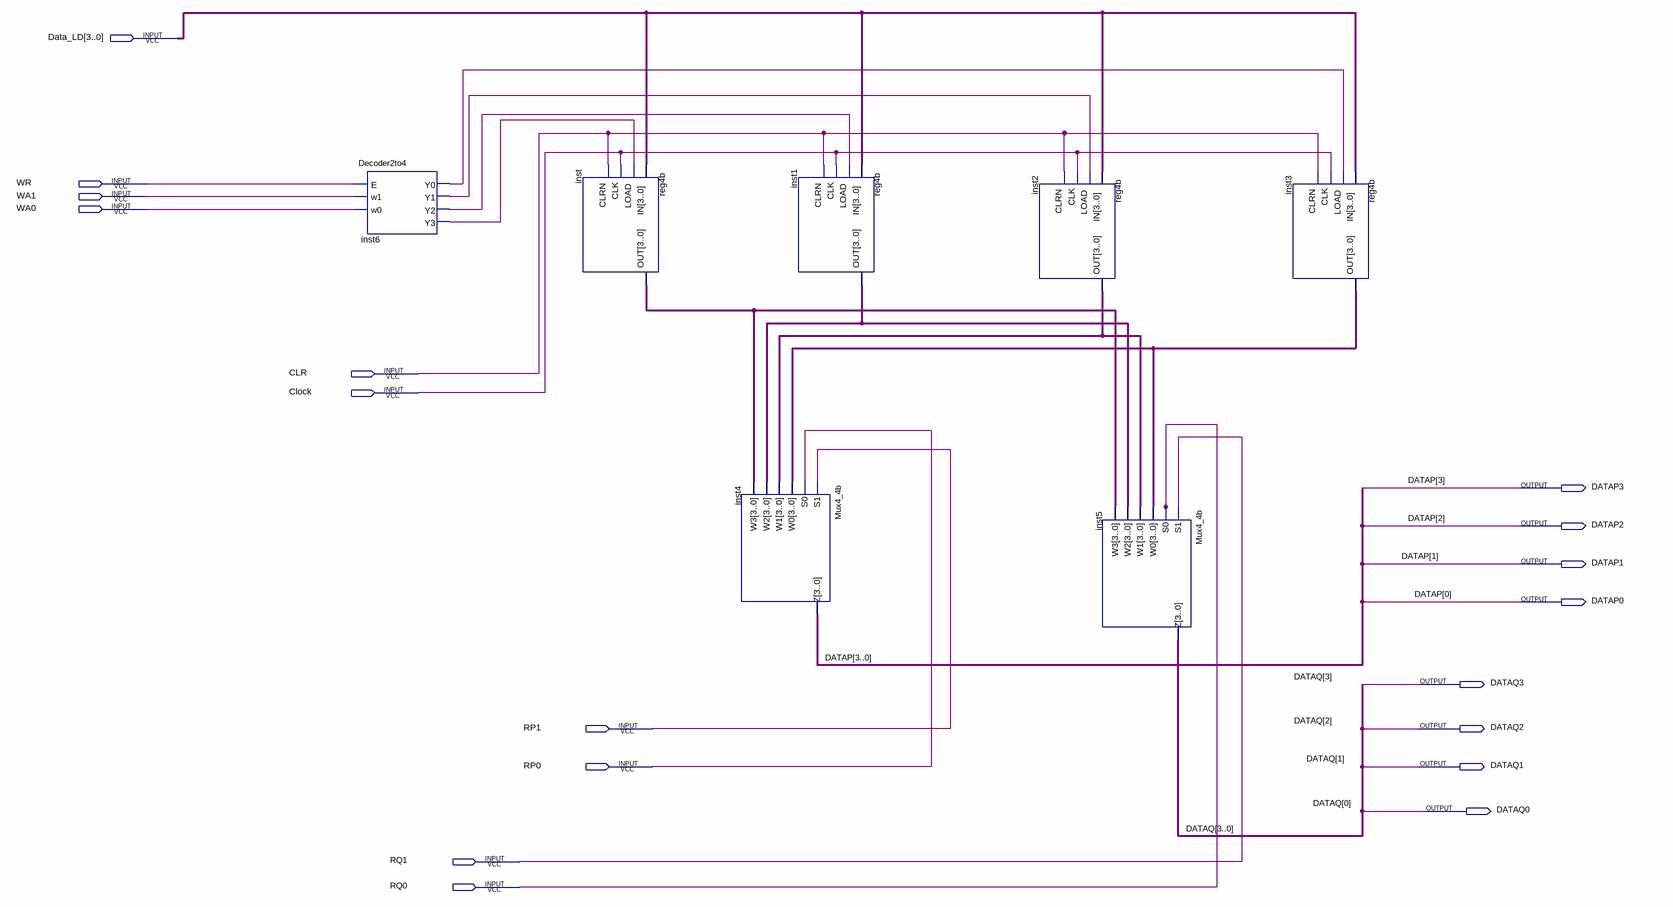
[diagram p0: schematic sheet]
// Quartus schematic register_file.bdf as structural Verilog: 7 symbols, 18 pins
module register_file (
  input  [3:0] Data_LD,
  input  WR,
  input  WA1,
  input  WA0,
  input  CLR,
  input  Clock,
  input  RP1,
  input  RP0,
  input  RQ1,
  input  RQ0,
  output DATAP3,
  output DATAP2,
  output DATAP1,
  output DATAP0,
  output DATAQ3,
  output DATAQ2,
  output DATAQ1,
  output DATAQ0
);

  wire inst6_y0, inst6_y1, inst6_y2, inst6_y3;
  wire [3:0] inst1_out, inst2_out, inst3_out, inst_out;

  Decoder2to4 inst6 (.E(WR), .w1(WA1), .w0(WA0), .Y0(inst6_y0), .Y1(inst6_y1), .Y2(inst6_y2), .Y3(inst6_y3));
  reg4b inst (.IN(Data_LD), .LOAD(inst6_y3), .CLK(Clock), .CLRN(CLR), .OUT(inst_out));
  Mux4_4b inst4 (
    .S1(RP1), .S0(RP0), .W0(inst3_out), .W1(inst2_out), .W2(inst1_out), .W3(inst_out),
    .Z({DATAP3, DATAP2, DATAP1, DATAP0}));
  reg4b inst1 (.IN(Data_LD), .LOAD(inst6_y2), .CLK(Clock), .CLRN(CLR), .OUT(inst1_out));
  reg4b inst2 (.IN(Data_LD), .LOAD(inst6_y1), .CLK(Clock), .CLRN(CLR), .OUT(inst2_out));
  Mux4_4b inst5 (
    .S1(RQ1), .S0(RQ0), .W0(inst3_out), .W1(inst2_out), .W2(inst1_out), .W3(inst_out),
    .Z({DATAQ3, DATAQ2, DATAQ1, DATAQ0}));
  reg4b inst3 (.IN(Data_LD), .LOAD(inst6_y0), .CLK(Clock), .CLRN(CLR), .OUT(inst3_out));
endmodule
